# Altium schematic sheet Connector_Inverter.SchDoc
size A4; Organization: UltraZohm; DocumentNumber: 2; SheetNumber: 2; SheetTotal: 11; Website: www.ultrazohm.com
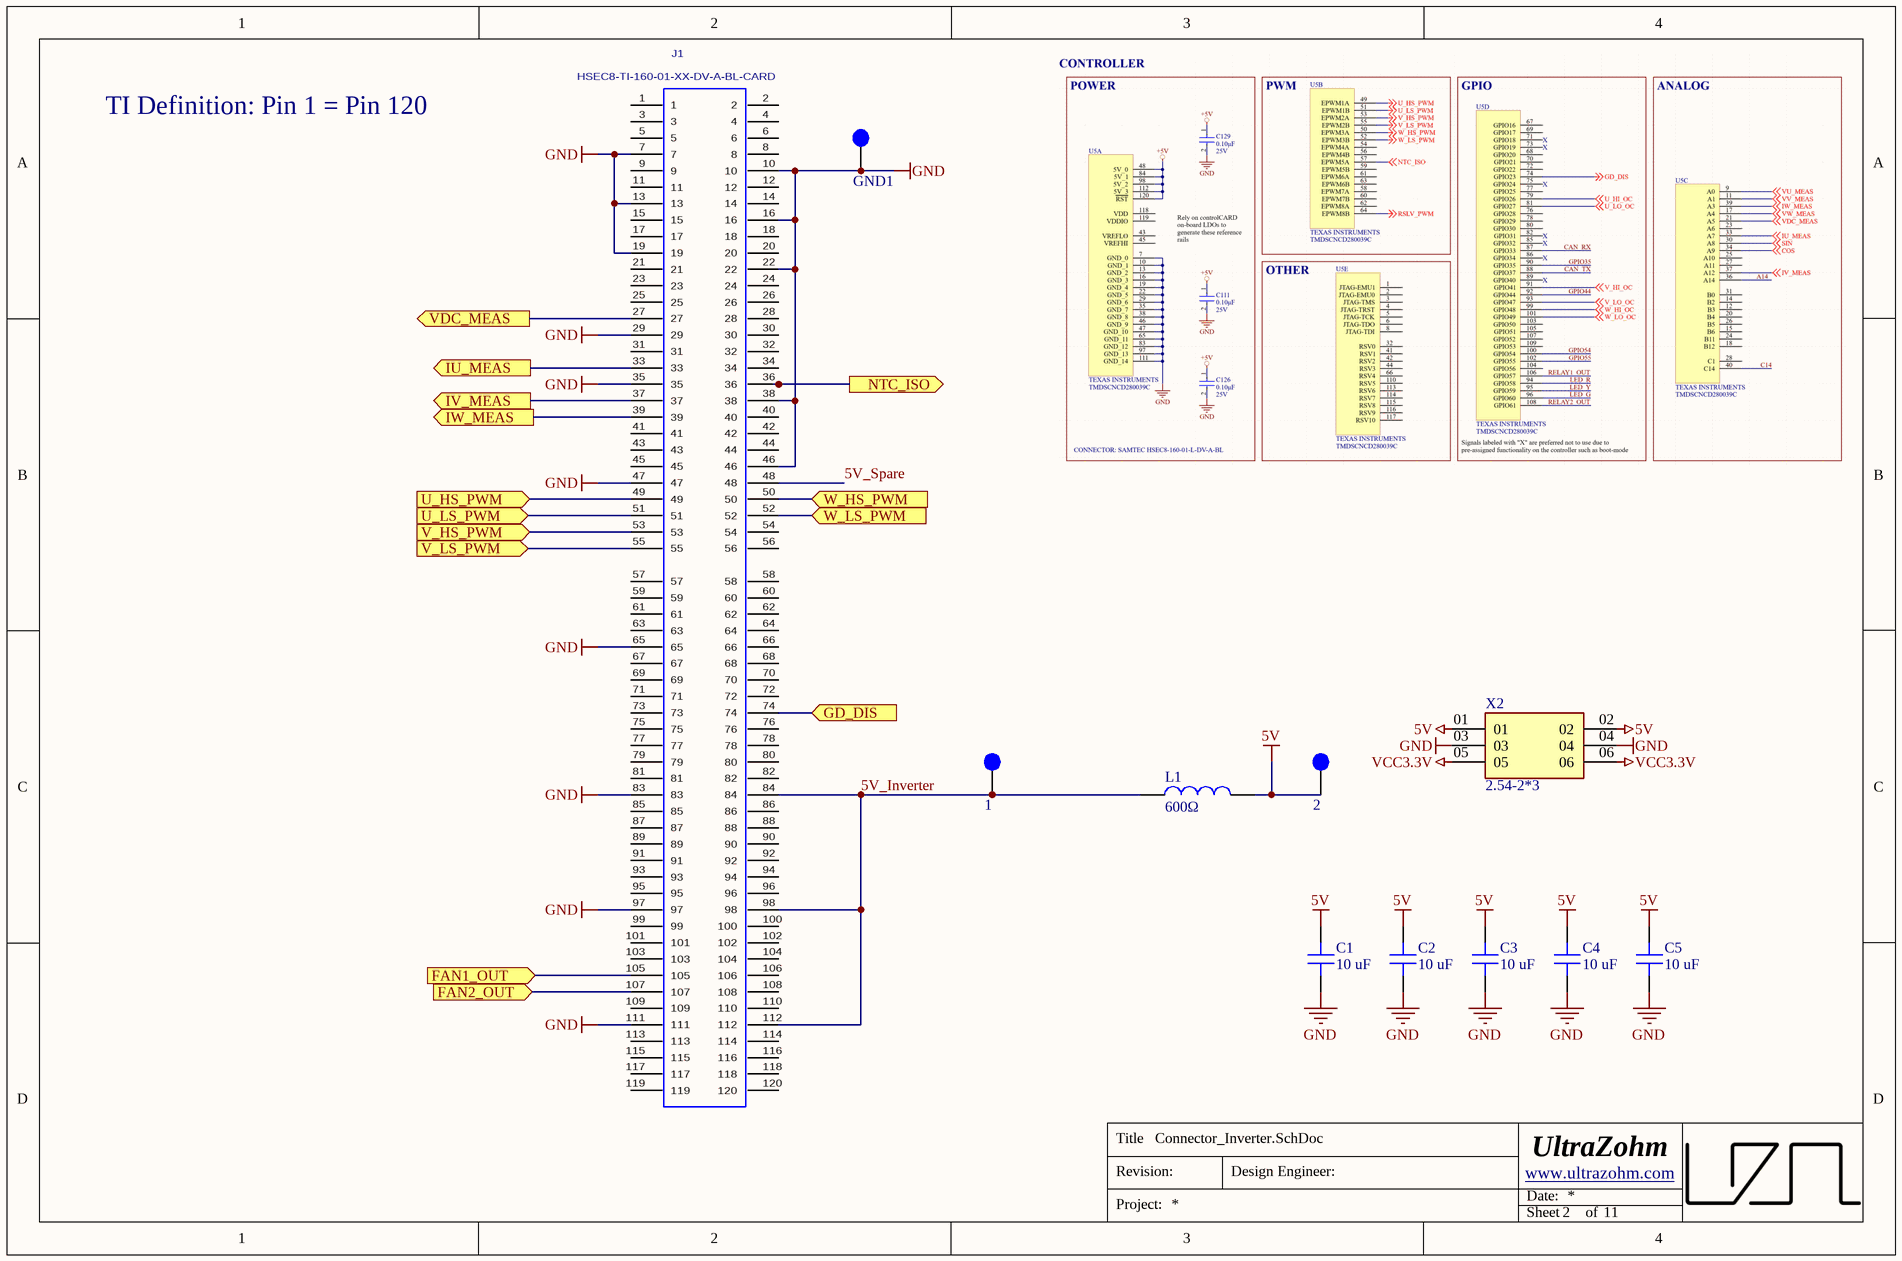
[diagram p0: Connector_Inverter.SchDoc]

## Parts
1  Testpoint 1mm  [TP_1mm]  (value not drawn)  (no BOM)
2  Testpoint 1mm  [TP_1mm]  (value not drawn)  (no BOM)
C1  10 uF  [C_1206]
C2  10 uF  [C_1206]
C3  10 uF  [C_1206]
C4  10 uF  [C_1206]
C5  10 uF  [C_1206]
GND1  Testpoint 1mm  [TP_1mm]  (value not drawn)  (no BOM)
J1  HSEC8-TI-160-01-XX-DV-A-BL-CARD  [HSEC8-TI-160-SAMTEC-Connector]
L1  600Ω  [WE-CBF_0805_High Current]
X2  2.54-2*3  [SAMTEC_TSW-103-05-G-D]

## Ports
FAN1_OUT (in, see TopSheet[2B]), FAN2_OUT (in, see TopSheet[2B]), GD_DIS (in, see TopSheet[2B], GateAndFanControl[1B]), IU_MEAS (out, see TopSheet[2B], OvercurrentDetection[1A]), IV_MEAS (out, see TopSheet[2B], OvercurrentDetection[1A]), IW_MEAS (out, see TopSheet[2B], OvercurrentDetection[1A]), NTC_ISO (out, see TopSheet[2A], TempSenseConditioning[1A]), U_HS_PWM (in, see TopSheet[2A]), U_LS_PWM (in, see TopSheet[2A]), V_HS_PWM (in, see TopSheet[2A]), V_LS_PWM (in, see TopSheet[2A]), VDC_MEAS (out, see TopSheet[2B]), W_HS_PWM (in, see TopSheet[2A]), W_LS_PWM (in, see TopSheet[2A])

## Nets
5V: 2.1 C1.1 C2.1 C3.1 C4.1 C5.1 L1.2 X2.01 X2.02
GND: C1.2 C2.2 C3.2 C4.2 C5.2 GND1.1 J1.7 J1.10 J1.13 J1.16 J1.19 J1.22 J1.29 J1.35 J1.38 J1.46 J1.47 J1.65 J1.83 J1.97 J1.111 X2.03 X2.04
VCC3.3V: X2.05 X2.06
5V_Inverter: 1.1 J1.84 J1.98 J1.112 L1.1
5V_Spare: J1.48
FAN1_OUT: J1.105 ; port FAN1_OUT
FAN2_OUT: J1.107 ; port FAN2_OUT
GD_DIS: J1.74 ; port GD_DIS
IU_MEAS: J1.33 ; port IU_MEAS
IV_MEAS: J1.37 ; port IV_MEAS
IW_MEAS: J1.39 ; port IW_MEAS
NTC_ISO: J1.36 ; port NTC_ISO
U_HS_PWM: J1.49 ; port U_HS_PWM
U_LS_PWM: J1.51 ; port U_LS_PWM
V_HS_PWM: J1.53 ; port V_HS_PWM
V_LS_PWM: J1.55 ; port V_LS_PWM
VDC_MEAS: J1.27 ; port VDC_MEAS
W_HS_PWM: J1.50 ; port W_HS_PWM
W_LS_PWM: J1.52 ; port W_LS_PWM

Not connected (* = marked no-connect by the designer): J1 1 2 3 4 5 6 8 9 11 12 14 15 17 18 20 21 23 24 25 26 28 30 31 32 34 40 41 42 43 44 45 54 56 57 58 59 60 61 62 63 64 66 67 68 69 70 71 72 73 75 76 77 78 79 80 81 82 85 86 87 88 89 90 91 92 93 94 95 96 99 100 101 102 103 104 106 108 109 110 113 114 115 116 117 118 119 120

## Notes on the sheet
- TI Definition: Pin 1 = Pin 120
- Title
- Revision:
- Design Engineer:
- Date:
- Project:
- Sheet
- of

## Library data of the parts
1 2 GND1 = TP_1mm: Created: 2018_06_25_AGeiger; Value: Testpoint 1mm
C1-C5 = CL31A106KBHNNNE: 50V 10uF X5R ±10% 1206 Multilayer Ceramic Capacitors MLCC - SMD/SMT ROHS; Manufacturer: Samsung Electro-Mechanics; Created from: SPark; Manufacturer Part Number: CL31A106KBHNNNE; PartID: 164; Created On: 28/02/2025 14:49:17; ComponentLink1Description: Datasheet; ComponentLink1URL: https://www.lcsc.com/datasheet/lcsc_datasheet_2304140030_Samsung-Electro-Mechanics-CL31A106KBHNNNE_C13585.pdf; Component Type: Capacitor 1206; Device Package: 1206; Last Updated: 28/02/2025 14:49:17; Mounting Type: SMD; Operating Temperature: -55 to + 85°C; Series: X5R; Supplier 1: LCSC; Supplier Part Number 1: C13585; Type: Capacitor; Tolerance: 10%; Voltage Rating: 50V; Value: 10 uF; Live Cycle Status: 1; LCSC Part Number: C13585
J1 = HSEC8-TI-160-01-XX-DV-A-BL-CARD: MATING CARD LAYOUT FOR HSEC8-160-01-XX-DV-A-BL.; MANUFACTURER: SAMTEC; PCB DECAL: HSEC8-160-01-XX-DV-A-BL-CARD; CREATED: April 20, 2018 - Wendy Xin; Design Item ID: HSEC8-160-01-XX-DV-A-BL-CARD; Source: HSEC8-160-01-XX-DV-A-BL-CARD.SCHLIB; Component Type: Standard; Pin Count: 120
L1 = WE-CBF, 742792040: WE-CBF SMD EMI Suppression Ferrite Bead, 0805, 600Ω; MF: Wurth Elektronik; Type: High Current; PublishedDate: Aug 2016; ComponentLink1Description: Manufacturer; ComponentLink1URL: http://www.we-online.de; ComponentLink2Description: Datasheet; ComponentLink2URL: http://katalog.we-online.de/pbs/datasheet/742792040.pdf; MPN: 742792040; Value: 600Ω; Package: 0805; Supplier 1: Farnell; Supplier 2: Mouser; Supplier 3: Digi-Key; Supplier Part Number 1: 2761567; Supplier Part Number 2: 710-742792040; Supplier Part Number 3: 732-1620-1-ND; LCSC Part Number: C98308
X2 = 2.54-2*3: Pin Header 3x2; Manufacturer: ZHOURI; MF: Samtec; Created from: KIlhan; Number of positions: 3; Availability: Unavailable; Value: *; Price: None; MP: TSW-103-05-G-D; Package: None; Manufacturer Part Number: 2.54-2*3; PartID: 14; Created On: 05.07.2023 16:24:09; ComponentLink1Description: Datasheet; ComponentLink1URL: https://datasheet.lcsc.com/lcsc/2207291800_ZHOURI-2-54-1-3_C5116482.pdf; Component Type: Pin Header; Device Package: THT; Last Updated: 11.02.2025 12:55:43; Mounting Type: THT; Operating Temperature: -55 -125 °C; Series: 2.54-1*3; Supplier 1: LCSC; Supplier Part Number 1: ZHOURI 2.54-1*3; Type: Pin Header; Live Cycle Status: 1; LCSC Part Number: C5116479; Stock number: not stored; Number of rows: 2